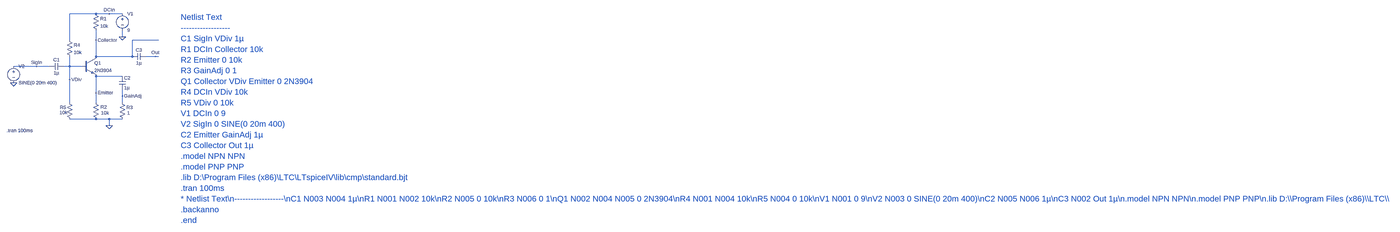
[diagram p0: schematic CommonEmitterAmp.asc, whole sheet]
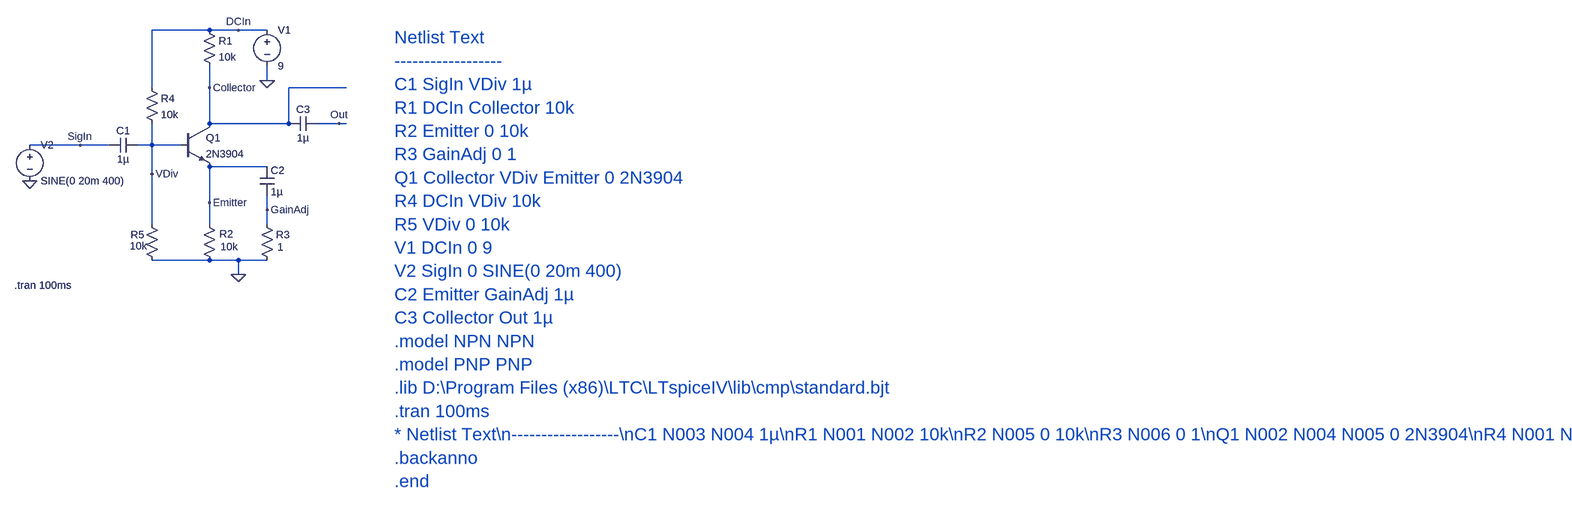
[diagram p1: schematic CommonEmitterAmp.asc, part, row 1 of 1, column 1 of 2]
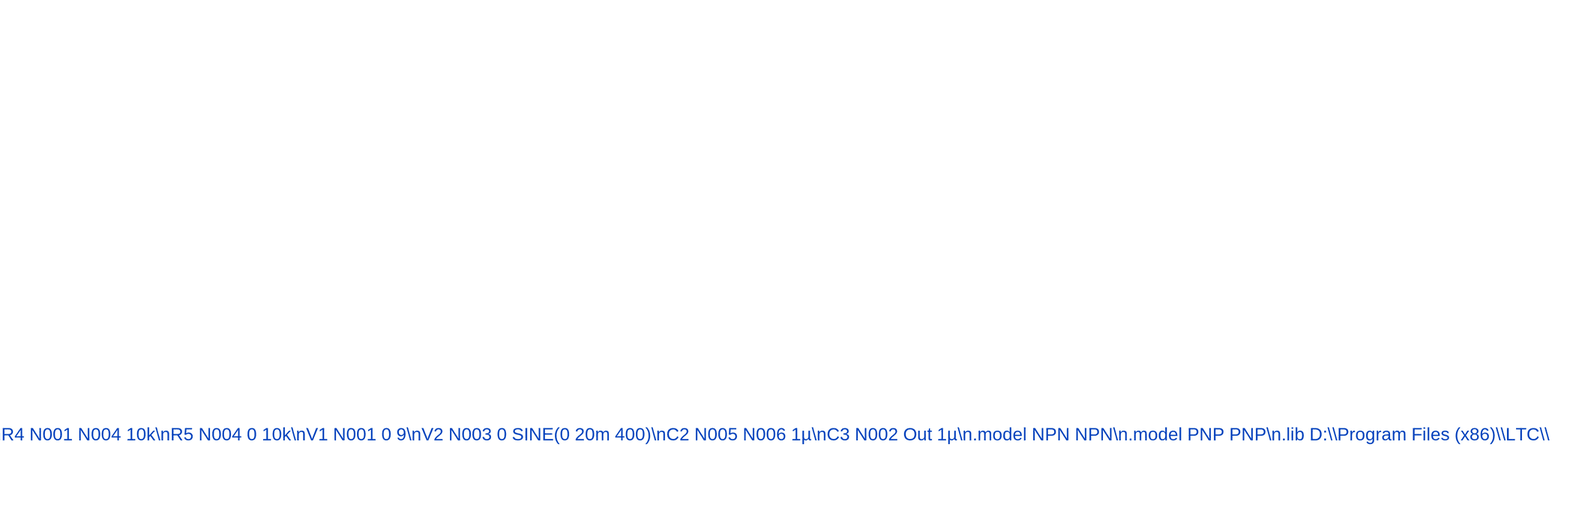
[diagram p2: schematic CommonEmitterAmp.asc, part, row 1 of 1, column 2 of 2]
CommonEmitterAmp.asc, the LTspice schematic file:
Version 4
SHEET 1 9288 1456
WIRE 240 -96 112 -96
WIRE 304 -96 240 -96
WIRE 368 -96 304 -96
WIRE 368 16 368 -16
WIRE 112 32 112 -96
WIRE 240 32 240 -16
WIRE 544 32 416 32
WIRE 240 112 240 32
WIRE 416 112 416 32
WIRE 416 112 240 112
WIRE 528 112 480 112
WIRE 544 112 528 112
WIRE -48 160 -160 160
WIRE 16 160 -48 160
WIRE 112 160 112 112
WIRE 112 160 80 160
WIRE 176 160 112 160
WIRE 368 208 240 208
WIRE 112 224 112 160
WIRE 240 288 240 208
WIRE 368 304 368 272
WIRE 112 336 112 224
WIRE 240 336 240 288
WIRE 368 336 368 304
WIRE 240 416 112 416
WIRE 304 416 240 416
WIRE 368 416 304 416
WIRE 304 448 304 416
FLAG 304 448 0
FLAG 368 16 0
FLAG -160 240 0
FLAG 528 112 Out
FLAG -48 160 SigIn
FLAG 304 -96 DCIn
FLAG 240 32 Collector
FLAG 240 288 Emitter
FLAG 112 224 VDiv
FLAG 368 304 GainAdj
SYMBOL cap 16 176 R270
WINDOW 0 32 32 VTop 2
WINDOW 3 0 32 VBottom 2
SYMATTR InstName C1
SYMATTR Value 1µ
SYMBOL res 224 -112 R0
SYMATTR InstName R1
SYMATTR Value 10k
SYMBOL res 224 320 R0
WINDOW 0 38 38 Left 2
WINDOW 3 -161 65 Left 2
SYMATTR InstName R2
SYMATTR Value 10k
SYMBOL res 352 320 R0
WINDOW 3 39 67 Left 2
SYMATTR InstName R3
SYMATTR Value 1
SYMBOL npn 176 112 R0
SYMATTR InstName Q1
SYMATTR Value 2N3904
SYMBOL res 96 16 R0
SYMATTR InstName R4
SYMATTR Value 10k
SYMBOL res 96 320 R0
WINDOW 0 -32 40 Left 2
WINDOW 3 168 66 Left 2
SYMATTR InstName R5
SYMATTR Value 10k
SYMBOL voltage 368 -112 R0
WINDOW 123 0 0 Left 2
WINDOW 39 0 0 Left 2
SYMATTR InstName V1
SYMATTR Value 9
SYMBOL voltage -160 144 R0
WINDOW 123 0 0 Left 2
WINDOW 39 0 0 Left 2
SYMATTR InstName V2
SYMATTR Value SINE(0 20m 400)
SYMBOL cap 352 208 R0
SYMATTR InstName C2
SYMATTR Value 1µ
SYMBOL cap 416 128 R270
WINDOW 0 32 32 VTop 2
WINDOW 3 0 32 VBottom 2
SYMATTR InstName C3
SYMATTR Value 1µ
TEXT -194 472 Left 2 !.tran 100ms
TEXT 1208 -80 Left 4 ;Netlist Text\n------------------\nC1 SigIn VDiv 1µ\nR1 DCIn Collector 10k\nR2 Emitter 0 10k\nR3 GainAdj 0 1\nQ1 Collector VDiv Emitter 0 2N3904\nR4 DCIn VDiv 10k\nR5 VDiv 0 10k\nV1 DCIn 0 9\nV2 SigIn 0 SINE(0 20m 400)\nC2 Emitter GainAdj 1µ\nC3 Collector Out 1µ\n.model NPN NPN\n.model PNP PNP\n.lib D:\\Program Files (x86)\\LTC\\LTspiceIV\\lib\\cmp\\standard.bjt\n.tran 100ms\n* Netlist Text\\n------------------\\nC1 N003 N004 1µ\\nR1 N001 N002 10k\\nR2 N005 0 10k\\nR3 N006 0 1\\nQ1 N002 N004 N005 0 2N3904\\nR4 N001 N004 10k\\nR5 N004 0 10k\\nV1 N001 0 9\\nV2 N003 0 SINE(0 20m 400)\\nC2 N005 N006 1µ\\nC3 N002 Out 1µ\\n.model NPN NPN\\n.model PNP PNP\\n.lib D:\\\\Program Files (x86)\\\\LTC\\\\LTspiceIV\\\\lib\\\\cmp\\\\standard.bjt\\n.tran 100ms\\n.backanno\\n.end\n.backanno\n.end

The netlist it stands for:
* CommonEmitterAmp.asc
C1 SigIn VDiv 1µ
R1 DCIn Collector 10k
R2 Emitter 0 10k
R3 GainAdj 0 1
Q1 Collector VDiv Emitter 0 2N3904
R4 DCIn VDiv 10k
R5 VDiv 0 10k
V1 DCIn 0 9
V2 SigIn 0 SINE(0 20m 400)
C2 Emitter GainAdj 1µ
C3 Collector Out 1µ
.model NPN NPN
.model PNP PNP
.lib standard.bjt
.tran 100ms
* Netlist Text
* ------------------
* C1 SigIn VDiv 1µ
* R1 DCIn Collector 10k
* R2 Emitter 0 10k
* R3 GainAdj 0 1
* Q1 Collector VDiv Emitter 0 2N3904
* R4 DCIn VDiv 10k
* R5 VDiv 0 10k
* V1 DCIn 0 9
* V2 SigIn 0 SINE(0 20m 400)
* C2 Emitter GainAdj 1µ
* C3 Collector Out 1µ
* .model NPN NPN
* .model PNP PNP
* .lib D:\Program Files (x86)\LTC\LTspiceIV\lib\cmp\standard.bjt
* .tran 100ms
* * Netlist Text\n------------------\nC1 N003 N004 1µ\nR1 N001 N002 10k\nR2 N005 0 10k\nR3 N006 0 1\nQ1 N002 N004 N005 0 2N3904\nR4 N001 N004 10k\nR5 N004 0 10k\nV1 N001 0 9\nV2 N003 0 SINE(0 20m 400)\nC2 N005 N006 1µ\nC3 N002 Out 1µ\n.model NPN NPN\n.model PNP PNP\n.lib D:\\Program Files (x86)\\LTC\\LTspiceIV\\lib\\cmp\\standard.bjt\n.tran 100ms\n.backanno\n.end
* .backanno
* .end
.backanno
.end